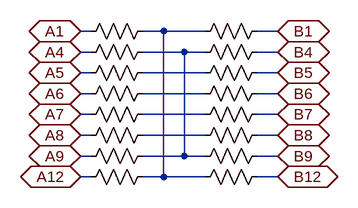
[diagram p0: schematic USB_C_16_Pin.asc]
USB_C_16_Pin.asc, the LTspice schematic file:
Version 4.1
SHEET 1 880 680
WIRE 96 112 80 112
WIRE 208 112 176 112
WIRE 272 112 208 112
WIRE 384 112 352 112
WIRE 96 144 80 144
WIRE 240 144 176 144
WIRE 272 144 240 144
WIRE 384 144 352 144
WIRE 96 176 80 176
WIRE 272 176 176 176
WIRE 384 176 352 176
WIRE 96 208 80 208
WIRE 272 208 176 208
WIRE 384 208 352 208
WIRE 96 240 80 240
WIRE 272 240 176 240
WIRE 384 240 352 240
WIRE 96 272 80 272
WIRE 272 272 176 272
WIRE 384 272 352 272
WIRE 96 304 80 304
WIRE 240 304 240 144
WIRE 240 304 176 304
WIRE 272 304 240 304
WIRE 384 304 352 304
WIRE 96 336 80 336
WIRE 208 336 208 112
WIRE 208 336 176 336
WIRE 272 336 208 336
WIRE 384 336 352 336
FLAG 80 112 A1
IOPIN 80 112 BiDir
FLAG 80 144 A4
IOPIN 80 144 BiDir
FLAG 80 176 A5
IOPIN 80 176 BiDir
FLAG 80 208 A6
IOPIN 80 208 BiDir
FLAG 80 240 A7
IOPIN 80 240 BiDir
FLAG 80 272 A8
IOPIN 80 272 BiDir
FLAG 80 304 A9
IOPIN 80 304 BiDir
FLAG 80 336 A12
IOPIN 80 336 BiDir
FLAG 384 112 B1
IOPIN 384 112 BiDir
FLAG 384 144 B4
IOPIN 384 144 BiDir
FLAG 384 176 B5
IOPIN 384 176 BiDir
FLAG 384 208 B6
IOPIN 384 208 BiDir
FLAG 384 240 B7
IOPIN 384 240 BiDir
FLAG 384 272 B8
IOPIN 384 272 BiDir
FLAG 384 304 B9
IOPIN 384 304 BiDir
FLAG 384 336 B12
IOPIN 384 336 BiDir
SYMBOL res 192 96 R90
WINDOW 0 0 56 Invisible 2
WINDOW 3 32 56 Invisible 2
SYMATTR InstName R1
SYMATTR Value 1m
SYMBOL res 192 128 R90
WINDOW 0 0 56 Invisible 2
WINDOW 3 32 56 Invisible 2
SYMATTR InstName R2
SYMATTR Value 1m
SYMBOL res 192 160 R90
WINDOW 0 0 56 Invisible 2
WINDOW 3 32 56 Invisible 2
SYMATTR InstName R3
SYMATTR Value 1m
SYMBOL res 192 192 R90
WINDOW 0 0 56 Invisible 2
WINDOW 3 32 56 Invisible 2
SYMATTR InstName R4
SYMATTR Value 1m
SYMBOL res 192 224 R90
WINDOW 0 0 56 Invisible 2
WINDOW 3 32 56 Invisible 2
SYMATTR InstName R5
SYMATTR Value 1m
SYMBOL res 192 256 R90
WINDOW 0 0 56 Invisible 2
WINDOW 3 32 56 Invisible 2
SYMATTR InstName R6
SYMATTR Value 1m
SYMBOL res 192 288 R90
WINDOW 0 0 56 Invisible 2
WINDOW 3 32 56 Invisible 2
SYMATTR InstName R7
SYMATTR Value 1m
SYMBOL res 192 320 R90
WINDOW 0 0 56 Invisible 2
WINDOW 3 32 56 Invisible 2
SYMATTR InstName R8
SYMATTR Value 1m
SYMBOL res 368 96 R90
WINDOW 0 0 56 Invisible 2
WINDOW 3 32 56 Invisible 2
SYMATTR InstName R9
SYMATTR Value 1m
SYMBOL res 368 128 R90
WINDOW 0 0 56 Invisible 2
WINDOW 3 32 56 Invisible 2
SYMATTR InstName R10
SYMATTR Value 1m
SYMBOL res 368 160 R90
WINDOW 0 0 56 Invisible 2
WINDOW 3 32 56 Invisible 2
SYMATTR InstName R11
SYMATTR Value 1m
SYMBOL res 368 192 R90
WINDOW 0 0 56 Invisible 2
WINDOW 3 32 56 Invisible 2
SYMATTR InstName R12
SYMATTR Value 1m
SYMBOL res 368 224 R90
WINDOW 0 0 56 Invisible 2
WINDOW 3 32 56 Invisible 2
SYMATTR InstName R13
SYMATTR Value 1m
SYMBOL res 368 256 R90
WINDOW 0 0 56 Invisible 2
WINDOW 3 32 56 Invisible 2
SYMATTR InstName R14
SYMATTR Value 1m
SYMBOL res 368 288 R90
WINDOW 0 0 56 Invisible 2
WINDOW 3 32 56 Invisible 2
SYMATTR InstName R15
SYMATTR Value 1m
SYMBOL res 368 320 R90
WINDOW 0 0 56 Invisible 2
WINDOW 3 32 56 Invisible 2
SYMATTR InstName R16
SYMATTR Value 1m

The netlist it stands for:
* USB_C_16_Pin.asc
R1 N001 A1 1m
R2 N002 A4 1m
R3 N003 A5 1m
R4 N004 A6 1m
R5 N005 A7 1m
R6 N006 A8 1m
R7 N002 A9 1m
R8 N001 A12 1m
R9 B1 N001 1m
R10 B4 N002 1m
R11 B5 N003 1m
R12 B6 N004 1m
R13 B7 N005 1m
R14 B8 N006 1m
R15 B9 N002 1m
R16 B12 N001 1m
.backanno
.end